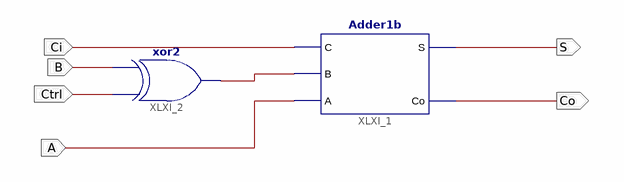
[diagram p0: schematic sheet 1]
// Xilinx ISE schematic AddSub1b.sch (kintex7) as structural Verilog: 2 symbols, 6 ports
module AddSub1b (
  input  A,
  input  Ci,
  input  B,
  input  Ctrl,
  output S,
  output Co
);

  wire XLXN_5;

  Adder1b XLXI_1 (.C(Ci), .B(XLXN_5), .A(A), .S(S), .Co(Co));
  xor XLXI_2 (XLXN_5, Ctrl, B);
endmodule
